# Altium schematic sheet Mainboard_User_Interface.SchDoc
size A4
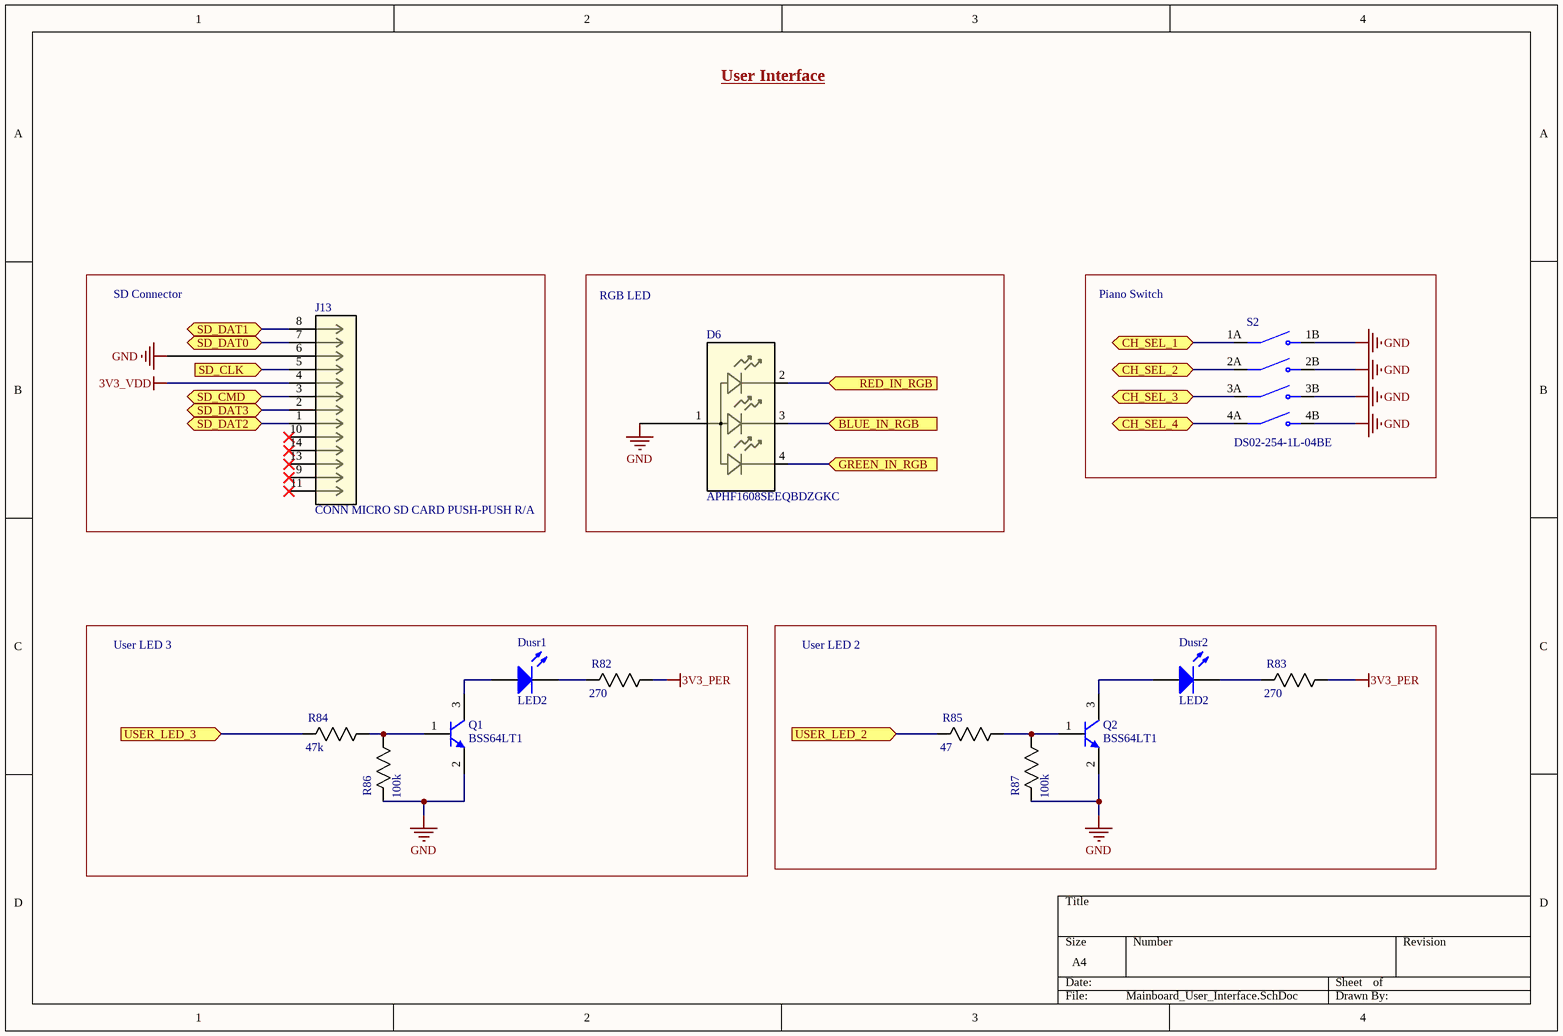
[diagram p0: Mainboard_User_Interface.SchDoc]

## Parts
D6  APHF1608SEEQBDZGKC  [LED RGB APHF1608SEEQBDZGKC_KNB-L]
Dusr1  LED2  [3.2X1.6X1.1]
Dusr2  LED2  [3.2X1.6X1.1]
J13  CONN MICRO SD CARD PUSH-PUSH R/A  [SD Connector 5027740891]
Q1  BSS64LT1  [ONSC-SOT-23-3-318-08_V]
Q2  BSS64LT1  [ONSC-SOT-23-3-318-08_V]
R82  270  [0805]
R83  270  [0805]
R84  47k  [0805]
R85  47  [0805]
R86  100k  [0805]
R87  100k  [0805]
S2  DS02-254-1L-04BE  [SW_DS02-254-1L-04BE]

## Blocks framed on the sheet
SD Connector: J13
RGB LED: D6
Piano Switch: S2
User LED 3: Dusr1 Q1 R82 R84 R86
User LED 2: Dusr2 Q2 R83 R85 R87

## Ports
BLUE_IN_RGB (in), CH_SEL_1 (bidir), CH_SEL_2 (bidir), CH_SEL_3 (bidir), CH_SEL_4 (bidir), GREEN_IN_RGB (in), RED_IN_RGB (in), SD_CLK (in), SD_CMD (bidir), SD_DAT0 (bidir), SD_DAT1 (bidir), SD_DAT2 (bidir), SD_DAT3 (bidir), USER_LED_2 (in), USER_LED_3 (in)

## Nets
3V3_PER: R82.1(R1) R83.1(R1)
3V3_VDD: J13.4
GND: D6.1 J13.6 Q1.2(E) Q2.2(E) R86.2(R2) R87.2(R2) S2.1B(NO1) S2.2B(NO2) S2.3B(NO3) S2.4B(NO4)
BLUE_IN_RGB: D6.3 ; port BLUE_IN_RGB
CH_SEL_1: S2.1A(COM1) ; port CH_SEL_1
CH_SEL_2: S2.2A(COM2) ; port CH_SEL_2
CH_SEL_3: S2.3A(COM3) ; port CH_SEL_3
CH_SEL_4: S2.4A(COM4) ; port CH_SEL_4
GREEN_IN_RGB: D6.4 ; port GREEN_IN_RGB
RED_IN_RGB: D6.2 ; port RED_IN_RGB
SD_CLK: J13.5 ; port SD_CLK
SD_CMD: J13.3 ; port SD_CMD
SD_DAT0: J13.7 ; port SD_DAT0
SD_DAT1: J13.8 ; port SD_DAT1
SD_DAT2: J13.1 ; port SD_DAT2
SD_DAT3: J13.2 ; port SD_DAT3
USER_LED_2: R85.2(R2) ; port USER_LED_2
USER_LED_3: R84.2(R2) ; port USER_LED_3
NetDusr1_1: Dusr1.1(A) Q1.3(C)
NetDusr1_2: Dusr1.2(K) R82.2(R2)
NetDusr2_1: Dusr2.1(A) Q2.3(C)
NetDusr2_2: Dusr2.2(K) R83.2(R2)
NetQ1_1: Q1.1(B) R84.1(R1) R86.1(R1)
NetQ2_1: Q2.1(B) R85.1(R1) R87.1(R1)

Not connected (* = marked no-connect by the designer): J13 9* 10* 11* 13* 14*

## Notes on the sheet
- User Interface

## Library data of the parts
D6 = LED RGB CLEAR 4SMD: Red, Green, Blue (RGB) 621nm Red, 525nm Green, 465nm Blue LED Indication - Discrete 2V Red, 3.3V Green, 3.3V Blue 4-SMD, No Lead; MF: Kingbright; ComponentLink1Description: Digikey; ComponentLink1URL: https://www.digikey.com/en/products/detail/kingbright/APHF1608SEEQBDZGKC/7597099; Digikey: 754-2144-1-ND; MP: APHF1608SEEQBDZGKC; ComponentLink2Description: Datasheet; ComponentLink2URL: https://www.kingbrightusa.com/images/catalog/SPEC/APHF1608SEEQBDZGKC.pdf
Dusr1 = LED RED SMD: Typical RED, GREEN, YELLOW, AMBER GaAs LED; Lens Color: Colorless; Voltage - Forward (Vf) (Typ): 1.7V; Current - Test: 20mA; Lens Transparency: Clear; Package: 1206; Color: Red
Dusr2 = LED GREEN SMD: Typical RED, GREEN, YELLOW, AMBER GaAs LED; Voltage - Forward (Vf) (Typ): 2V; Lens Transparency: Clear; Current - Test: 20mA; Package: 1206; Color: Green
J13 = CONN MICRO SD CARD PUSH-PUSH R/A: 10 (8 + 2) Position Card Connector Secure Digital - microSD™ Surface Mount, Right Angle Gold; MF: Molex; MP: 5027740891; ComponentLink1Description: Digikey; ComponentLink1URL: https://www.digikey.ca/en/products/detail/molex/5027740891/1952536; Digikey: WM24066CT-ND; ComponentLink2Description: Datasheet; ComponentLink2URL: https://www.molex.com/pdm_docs/sd/5027740891_sd.pdf
Q1 Q2 = CMP-1048-00605-1: Driver Transistor, NPN Silicon, 3-Pin SOT-23, Tape and Reel; Manufacturer: On Semiconductor; IC Continuous (A): 0.1; fT Min (MHz): 60; ComponentLink1Description: Manufacturer URL; ComponentLink3Description: Package Specification; ComponentLink2URL: http://www.onsemi.com/pub_link/Collateral/BSS64LT1-D.PDF; ComponentLink1URL: http://www.onsemi.com/; ComponentLink2Description: Datasheet; ComponentLink3URL: http://www.onsemi.cn/pub_link/Collateral/318-08.PDF; RoHS: FALSE; PackageVersion: Rev. AP, 11/2009; Polarity: NPN; PartNumber: BSS64LT1; Mounting Technology: Surface Mount; PackageDescription: 3-Pin Small Outline Transistor, Body 2.92 x 1.3 mm, Pitch 0.95 mm; Packing: Tape and Reel; DatasheetVersion: Rev. 5; PackageReference: SOT-23-3-318-08
R82 R83 = RES 270.0 1/8W: RES SMD 270 OHM 5% 1/8W 0805; Power (Watts): 0.125W; Package: 0805; Value: 270; Tolerance: 5%
R84 = RES 47k 1/8W - 1%: RES SMD 47K OHM 1% 1/8W 0805; Power (Watts): 0.125W; Package: 0805; Value: 47k; Tolerance: 1%
R85 = RES 47.0 1/8W - 1%: RES SMD 47 OHM 1% 1/8W 0805; Power (Watts): 0.125W; Package: 0805; Value: 47; Tolerance: 1%
R86 R87 = RES 100k 1/8W - 1%: RES SMD 100K OHM 1% 1/8W 0805; Power (Watts): 0.125W; Package: 0805; Value: 100k; Tolerance: 1%
S2 = DS02-254-1L-04BE: Dip Switch Piano Key 4-position; Package: None; Price: None; Value: *; MP: DS02-254-1L-04BE; Availability: Unavailable